# Altium schematic sheet Peripheral Connections.SchDoc
size B; SheetNumber: 4; SheetTotal: 5
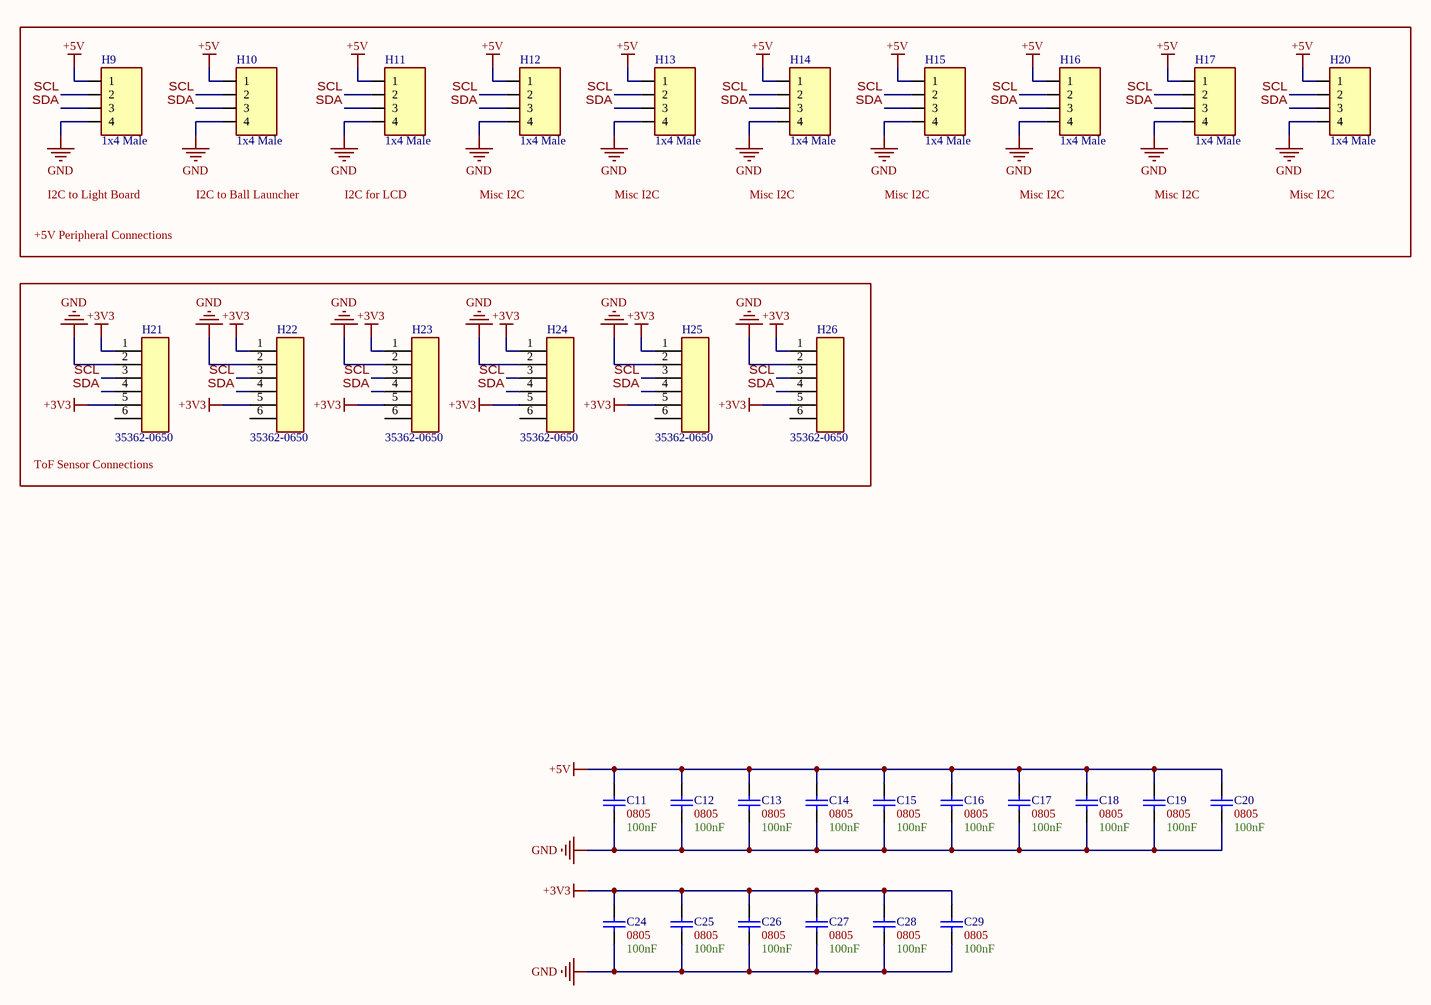
[diagram p0: Peripheral Connections.SchDoc]

## Parts
C11  Size Package: 0805  Capacitance: 100nF  [[Cap] SMD 0805]  (hidden comment: SMD Nonpolarized)
C12  Size Package: 0805  Capacitance: 100nF  [[Cap] SMD 0805]  (hidden comment: SMD Nonpolarized)
C13  Size Package: 0805  Capacitance: 100nF  [[Cap] SMD 0805]  (hidden comment: SMD Nonpolarized)
C14  Size Package: 0805  Capacitance: 100nF  [[Cap] SMD 0805]  (hidden comment: SMD Nonpolarized)
C15  Size Package: 0805  Capacitance: 100nF  [[Cap] SMD 0805]  (hidden comment: SMD Nonpolarized)
C16  Size Package: 0805  Capacitance: 100nF  [[Cap] SMD 0805]  (hidden comment: SMD Nonpolarized)
C17  Size Package: 0805  Capacitance: 100nF  [[Cap] SMD 0805]  (hidden comment: SMD Nonpolarized)
C18  Size Package: 0805  Capacitance: 100nF  [[Cap] SMD 0805]  (hidden comment: SMD Nonpolarized)
C19  Size Package: 0805  Capacitance: 100nF  [[Cap] SMD 0805]  (hidden comment: SMD Nonpolarized)
C20  Size Package: 0805  Capacitance: 100nF  [[Cap] SMD 0805]  (hidden comment: SMD Nonpolarized)
C24  Size Package: 0805  Capacitance: 100nF  [[Cap] SMD 0805]  (hidden comment: SMD Nonpolarized)
C25  Size Package: 0805  Capacitance: 100nF  [[Cap] SMD 0805]  (hidden comment: SMD Nonpolarized)
C26  Size Package: 0805  Capacitance: 100nF  [[Cap] SMD 0805]  (hidden comment: SMD Nonpolarized)
C27  Size Package: 0805  Capacitance: 100nF  [[Cap] SMD 0805]  (hidden comment: SMD Nonpolarized)
C28  Size Package: 0805  Capacitance: 100nF  [[Cap] SMD 0805]  (hidden comment: SMD Nonpolarized)
C29  Size Package: 0805  Capacitance: 100nF  [[Cap] SMD 0805]  (hidden comment: SMD Nonpolarized)
H9  1x4 Male  [[Header] Shrouded 1x4 Male]
H10  1x4 Male  [[Header] Shrouded 1x4 Male]
H11  1x4 Male  [[Header] Shrouded 1x4 Male]
H12  1x4 Male  [[Header] Shrouded 1x4 Male]
H13  1x4 Male  [[Header] Shrouded 1x4 Male]
H14  1x4 Male  [[Header] Shrouded 1x4 Male]
H15  1x4 Male  [[Header] Shrouded 1x4 Male]
H16  1x4 Male  [[Header] Shrouded 1x4 Male]
H17  1x4 Male  [[Header] Shrouded 1x4 Male]
H20  1x4 Male  [[Header] Shrouded 1x4 Male]
H21  35362-0650  [[Sherlock] 6pin]
H22  35362-0650  [[Sherlock] 6pin]
H23  35362-0650  [[Sherlock] 6pin]
H24  35362-0650  [[Sherlock] 6pin]
H25  35362-0650  [[Sherlock] 6pin]
H26  35362-0650  [[Sherlock] 6pin]

## Blocks framed on the sheet
ToF Sensor Connections: H21-H26

## Nets
+3V3: C24.2 C25.2 C26.2 C27.2 C28.2 C29.2 H21.1 H21.5 H22.1 H22.5 H23.1 H23.5 H24.1 H24.5 H25.1 H25.5 H26.1 H26.5
+5V: C11.2 C12.2 C13.2 C14.2 C15.2 C16.2 C17.2 C18.2 C19.2 C20.2 H9.1 H10.1 H11.1 H12.1 H13.1 H14.1 H15.1 H16.1 H17.1 H20.1
GND: C11.1 C12.1 C13.1 C14.1 C15.1 C16.1 C17.1 C18.1 C19.1 C20.1 C24.1 C25.1 C26.1 C27.1 C28.1 C29.1 H9.4 H10.4 H11.4 H12.4 H13.4 H14.4 H15.4 H16.4 H17.4 H20.4 H21.2 H22.2 H23.2 H24.2 H25.2 H26.2
SCL: H9.2 H10.2 H11.2 H12.2 H13.2 H14.2 H15.2 H16.2 H17.2 H20.2 H21.3 H22.3 H23.3 H24.3 H25.3 H26.3
SDA: H9.3 H10.3 H11.3 H12.3 H13.3 H14.3 H15.3 H16.3 H17.3 H20.3 H21.4 H22.4 H23.4 H24.4 H25.4 H26.4

Not connected (* = marked no-connect by the designer): H21 6; H22 6; H23 6; H24 6; H25 6; H26 6

## Notes on the sheet
- I2C to Light Board
- I2C to Ball Launcher
- I2C for LCD
- Misc I2C
- +5V Peripheral Connections

## Library data of the parts
C11-C20 C24-C29 = [Cap] SMD Nonpolarized
H9-H17 H20 = [Header] Shrouded 1x4 Male: 70543-0003 / Mates with 0050579404
H21-H26 = [Sherlock] 6pin: 2.00mm pitch